# EAGLE design through_hole_v2_proto (EAGLE 5.12)
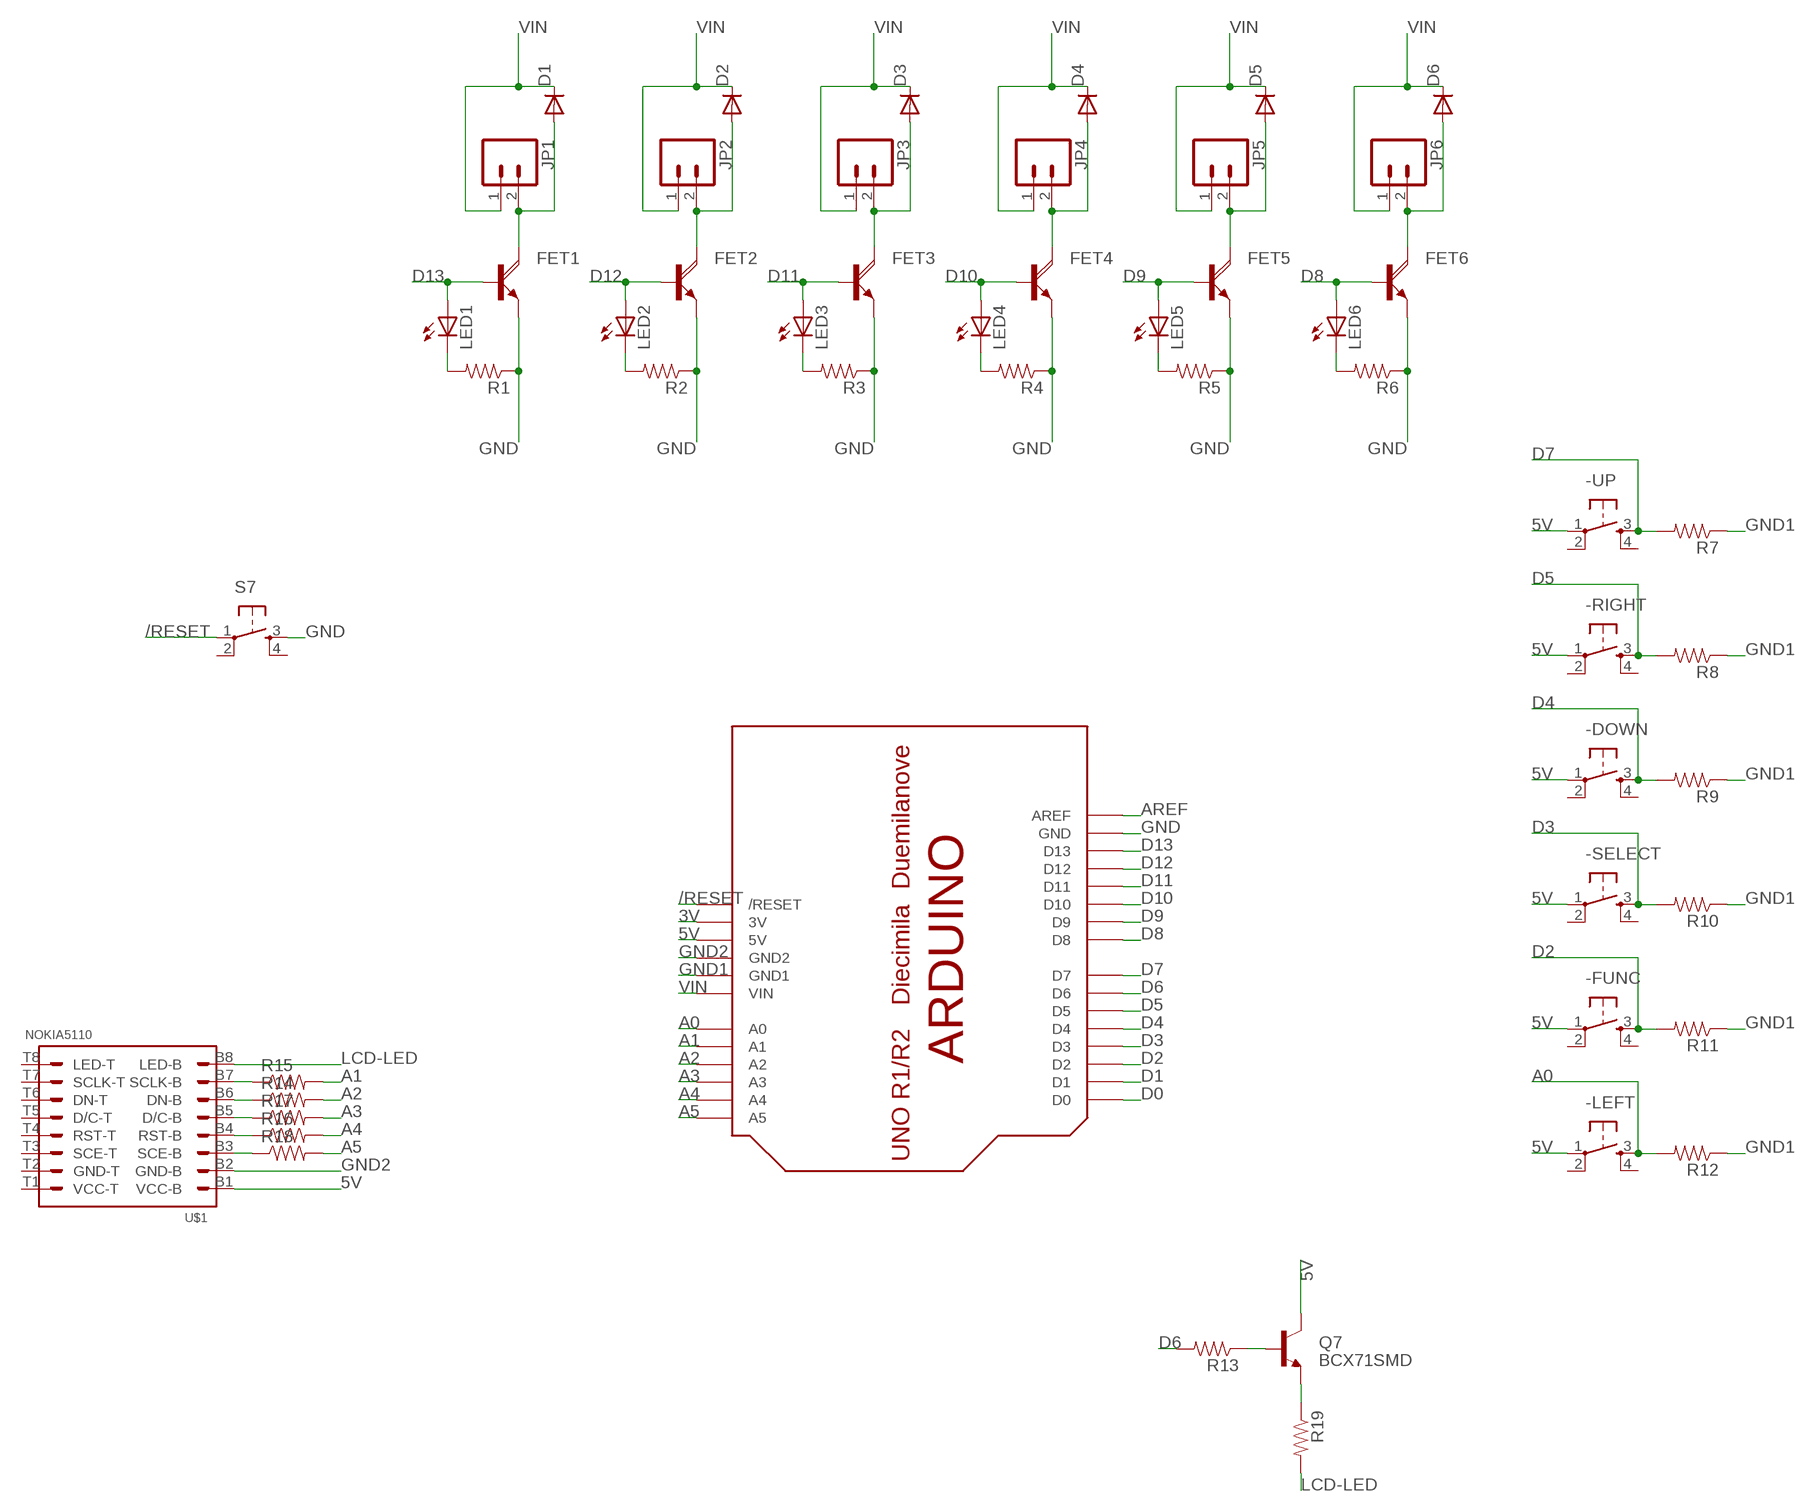
[diagram p0: schematic, sheet 1]

## Parts
-DOWN  TAC_SWITCHPTH  [TACTILE-PTH]
-FUNC  TAC_SWITCHPTH  [TACTILE-PTH]
-LEFT  TAC_SWITCHPTH  [TACTILE-PTH]
-RIGHT  TAC_SWITCHPTH  [TACTILE-PTH]
-SELECT  TAC_SWITCHPTH  [TACTILE-PTH]
-UP  TAC_SWITCHPTH  [TACTILE-PTH]
D1  DIODE1N4148  [DIODE-1N4148]
D2  DIODE1N4148  [DIODE-1N4148]
D3  DIODE1N4148  [DIODE-1N4148]
D4  DIODE1N4148  [DIODE-1N4148]
D5  DIODE1N4148  [DIODE-1N4148]
D6  DIODE1N4148  [DIODE-1N4148]
FET1  TIP120  [TO220AH]
FET2  TIP120  [TO220AH]
FET3  TIP120  [TO220AH]
FET4  TIP120  [TO220AH]
FET5  TIP120  [TO220AH]
FET6  TIP120  [TO220AH]
JP1  M02LOCK_LONGPADS  [1X02_LOCK_LONGPADS]
JP2  M02LOCK_LONGPADS  [1X02_LOCK_LONGPADS]
JP3  M02LOCK_LONGPADS  [1X02_LOCK_LONGPADS]
JP4  M02LOCK_LONGPADS  [1X02_LOCK_LONGPADS]
JP5  M02LOCK_LONGPADS  [1X02_LOCK_LONGPADS]
JP6  M02LOCK_LONGPADS  [1X02_LOCK_LONGPADS]
LED1  LED3MM  [LED3MM]
LED2  LED3MM  [LED3MM]
LED3  LED3MM  [LED3MM]
LED4  LED3MM  [LED3MM]
LED5  LED3MM  [LED3MM]
LED6  LED3MM  [LED3MM]
Q7  BCX71SMD  TRANSISTOR_NPNTO92  [TO-92]
R1  RESISTORPTH1  [AXIAL-0.3]
R2  RESISTORPTH1  [AXIAL-0.3]
R3  RESISTORPTH1  [AXIAL-0.3]
R4  RESISTORPTH1  [AXIAL-0.3]
R5  RESISTORPTH1  [AXIAL-0.3]
R6  RESISTORPTH1  [AXIAL-0.3]
R7  RESISTORPTH1  [AXIAL-0.3]
R8  RESISTORPTH1  [AXIAL-0.3]
R9  RESISTORPTH1  [AXIAL-0.3]
R10  RESISTORPTH1  [AXIAL-0.3]
R11  RESISTORPTH1  [AXIAL-0.3]
R12  RESISTORPTH1  [AXIAL-0.3]
R13  RESISTORPTH1  [AXIAL-0.3]
R14  RESISTORPTH1  [AXIAL-0.3]
R15  RESISTORPTH1  [AXIAL-0.3]
R16  RESISTORPTH1  [AXIAL-0.3]
R17  RESISTORPTH1  [AXIAL-0.3]
R18  RESISTORPTH1  [AXIAL-0.3]
R19  RESISTORPTH1  [AXIAL-0.3]
S7  TAC_SWITCHPTH  [TACTILE-PTH]
U$1  NOKIA5110  [NOKIA5110]
U$2  ARDUINOUNO  [ARDUINO]

## Nets
3V: U$2.3V
5V: -DOWN.1 -FUNC.1 -LEFT.1 -RIGHT.1 -SELECT.1 -UP.1 Q7.3(C) U$1.B1(VCC-B) U$2.5V
/RESET: S7.1 U$2.RESET(/RESET)
A0: -LEFT.3 R12.P$2 U$2.A0
A1: R15.P$2 U$2.A1
A2: R14.P$2 U$2.A2
A3: R17.P$2 U$2.A3
A4: R16.P$2 U$2.A4
A5: R18.P$2 U$2.A5
AREF: U$2.AREF
D0: U$2.D0
D1: U$2.D1
D2: -FUNC.3 R11.P$2 U$2.D2
D3: -SELECT.3 R10.P$2 U$2.D3
D4: -DOWN.3 R9.P$2 U$2.D4
D5: -RIGHT.3 R8.P$2 U$2.D5
D6: R13.P$2 U$2.D6
D7: -UP.3 R7.P$2 U$2.D7
D8: FET6.B LED6.A U$2.D8
D9: FET5.B LED5.A U$2.D9
D10: FET4.B LED4.A U$2.D10
D11: FET3.B LED3.A U$2.D11
D12: FET2.B LED2.A U$2.D12
D13: FET1.B LED1.A U$2.D13
GND: FET1.E FET2.E FET3.E FET4.E FET5.E FET6.E R1.P$1 R2.P$1 R3.P$1 R4.P$1 R5.P$1 R6.P$1 S7.3 U$2.GND
GND1: R7.P$1 R8.P$1 R9.P$1 R10.P$1 R11.P$1 R12.P$1 U$2.GND1
GND2: U$1.B2(GND-B) U$2.GND2
LCD-LED: R19.P$2 U$1.B8(LED-B)
N$1: LED2.K(C) R2.P$2
N$2: LED1.K(C) R1.P$2
N$3: D2.A FET2.C JP2.2
N$4: Q7.2(B) R13.P$1
N$5: LED3.K(C) R3.P$2
N$6: R15.P$1 U$1.B7(SCLK-B)
N$7: D3.A FET3.C JP3.2
N$8: LED4.K(C) R4.P$2
N$9: D4.A FET4.C JP4.2
N$10: LED5.K(C) R5.P$2
N$11: D5.A FET5.C JP5.2
N$12: LED6.K(C) R6.P$2
N$13: D1.A FET1.C JP1.2
N$14: D6.A FET6.C JP6.2
N$16: Q7.1(E) R19.P$1
N$32: R14.P$1 U$1.B6(DN-B)
N$36: R17.P$1 U$1.B5(D/C-B)
N$38: R16.P$1 U$1.B4(RST-B)
N$39: R18.P$1 U$1.B3(SCE-B)
VIN: D1.C D2.C D3.C D4.C D5.C D6.C JP1.1 JP2.1 JP3.1 JP4.1 JP5.1 JP6.1 U$2.VIN
Unconnected: -DOWN.2 -DOWN.4 -FUNC.2 -FUNC.4 -LEFT.2 -LEFT.4 -RIGHT.2 -RIGHT.4 -SELECT.2 -SELECT.4 -UP.2 -UP.4 S7.2 S7.4 U$1.T1(VCC-T) U$1.T2(GND-T) U$1.T3(SCE-T) U$1.T4(RST-T) U$1.T5(D/C-T) U$1.T6(DN-T) U$1.T7(SCLK-T) U$1.T8(LED-T)

## Library data of the parts
-DOWN -FUNC -LEFT -RIGHT -SELECT -UP S7 = SparkFun:TAC_SWITCH: Momentary Switch Button commonly used for reset or general input. Spark Fun Electronics SKU : COM-00097
D1-D6 = SparkFun:DIODE: Diode These are standard reverse protection diodes and small signal diodes. SMA package can handle up to about 1A. SOD-323 can handle about 200mA. What the SOD-323 package when ordering, there are some mfgs out there that are 5-pin packages.
FET1-FET6 = jowan-transistor-power:TIP120: NPN DARLINGTON TRANSISTOR
JP1-JP6 = SparkFun:M02: Header 2 Standard 2-pin 0.1" header. Use with straight break away headers (SKU : PRT-00116), right angle break away headers (PRT-00553), swiss pins (PRT-00743), machine pins (PRT-00117), and female headers (PRT-00115). Molex polarized connector foot print use with SKU : PRT-08233 with associated crimp pins and housings.
LED1-LED6 = adafruit:LED: LED OSRAM: - CHIPLED LG R971, LG N971, LY N971, LG Q971, LY Q971, LO R971, LY R971 LH N974, LH R974 LS Q976, LO Q976, LY Q976 LO Q996 - Hyper CHIPLED LW Q18S LB Q993, LB Q99A, LB R99A - SideLED LS A670, LO A670, LY A670, LG A670, LP A670 LB A673, LV A673, LT A673, LW A673 LH A674 LY A675 LS A676, LA A676, LO A676, LY A676, LW A676 LS A679, LY A679, LG A679 - Hyper Micro SIDELED® LS Y876, LA Y876, LO Y876, LY Y876 LT Y87S - SmartLED LW L88C, LW L88S LB L89C, LB L89S, LG L890 LS L89K, LO L89K, LY L89K LS L896, LA L896, LO L896, LY L896 - TOPLED LS T670, LO T670, LY T670, LG T670, LP T670 LSG T670, LSP T670, LSY T670, LOP T670, LYG T670 LG T671, LOG T671, LSG T671 LB T673, LV T673, LT T673, LW T673 LH T674 LS T676, LA T676, LO T676, LY T676, LB T676, LH T676, LSB T676, LW T676 LB T67C, LV T67C, LT T67C, LS T67K, LO T67K, LY T67K, LW E67C LS E67B, LA E67B, LO E67B, LY E67B, LB E67C, LV E67C, LT E67C LW T67C LS T679, LY T679, LG T679 LS T770, LO T770, LY T770, LG T770, LP T770 LB T773, LV T773, LT T773, LW T773 LH T774 LS E675, LA E675, LY E675, LS T675 LS T776, LA T776, LO T776, LY T776, LB T776 LHGB T686 LT T68C, LB T68C - Hyper Mini TOPLED® LB M676 - Mini TOPLED Santana® LG M470 LS M47K, LO M47K, LY M47K Source: http://www.osram.convergy.de/
Q7 = SparkFun:TRANSISTOR_NPN: Transistor NPN BJT configuration in SOT23 package. MMBT2222 is the common NPN we use. Double check BCE configuration again layout.
R1-R19 = SparkFun:RESISTOR: Resistor Basic schematic elements and footprints for 0603, 1206, and PTH 1/10th watt (small) resistors.
U$1 = CustomLib:NOKIA5110
U$2 = jowan_ard:ARDUINO: Arduino Diecimila/Duemilanove Make a shield with ease, this package has all the named pins as well as the two mounting drill holes and an outline of the USB and DC power connector. The outline is on the DIMENSION layer, so if your board house uses it they will cut the outline to match. http://www.ladyada.net/library/pcb/eaglelibrary.html

## Board
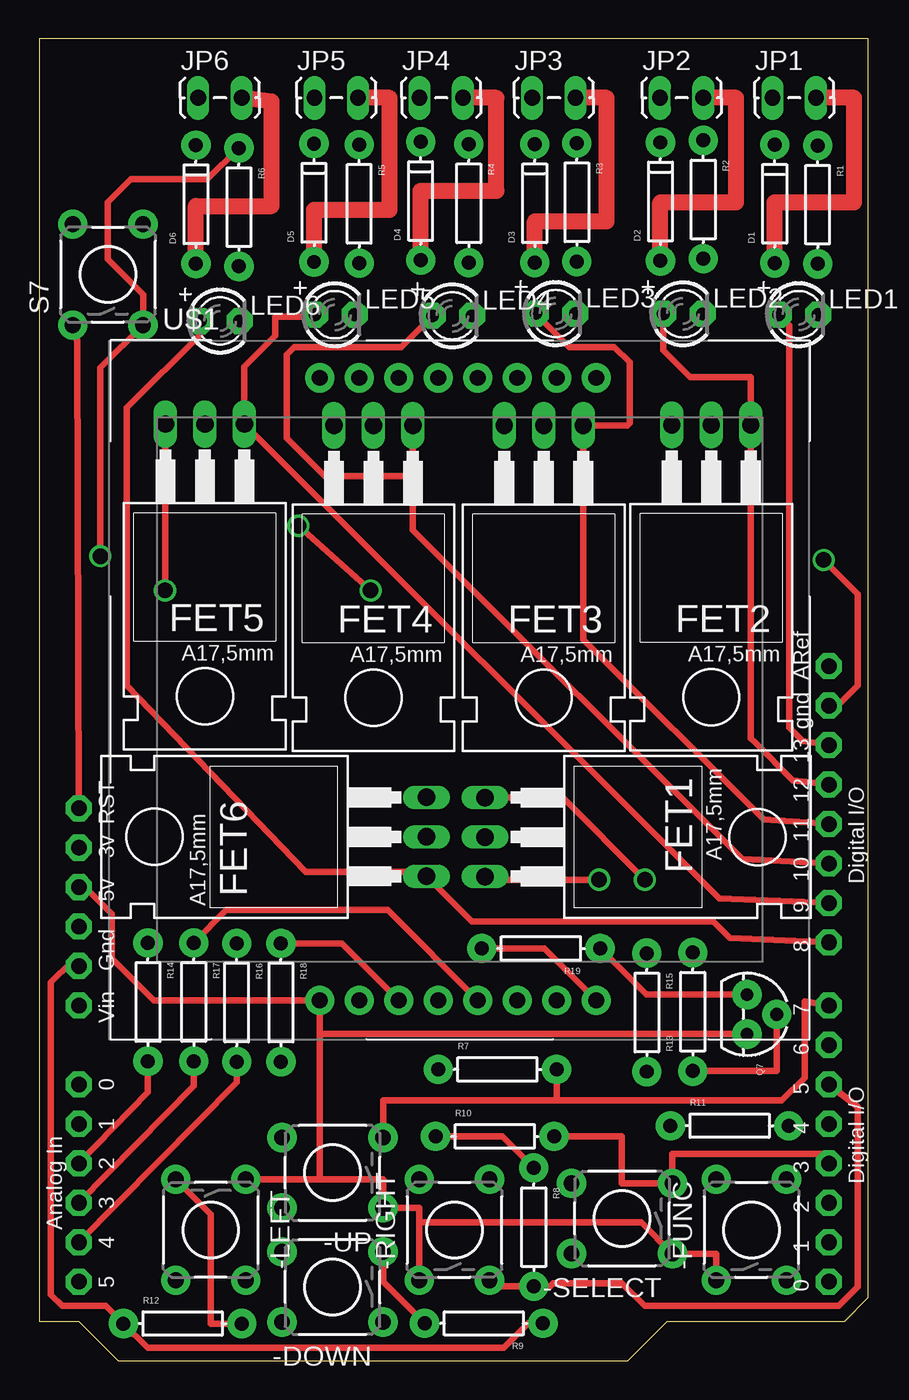
[diagram p1: board, top side]
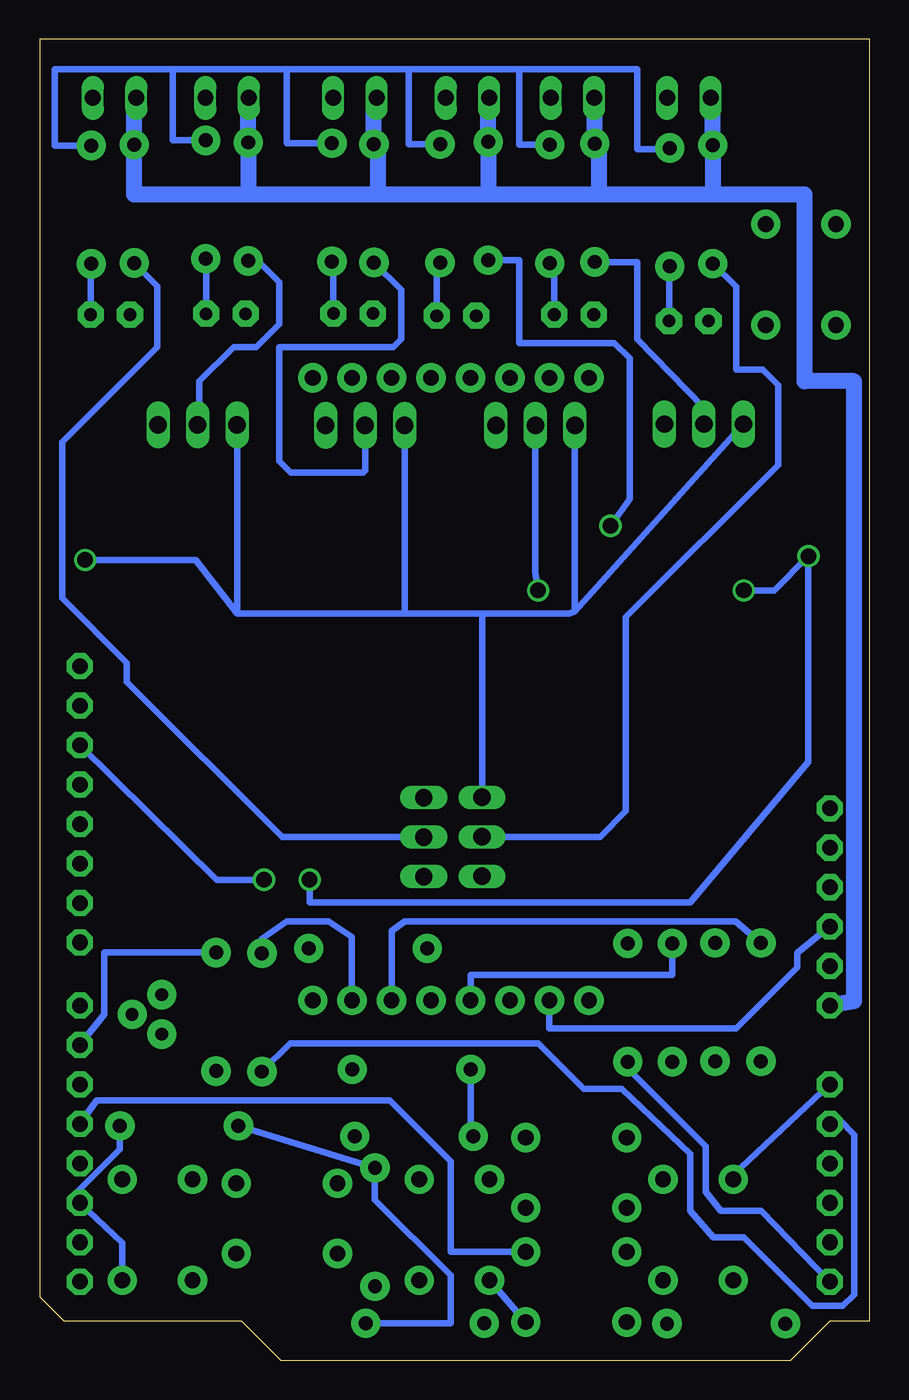
[diagram p2: board, bottom side, seen from below]

Size 53.34 x 85.09 mm. Coordinates in mm from the lower left corner, seen from the top.
Copper layers (1*16): Top 0.035mm / dielectric 1.5mm / Bottom 0.035mm
Design rules "PCB-POOL HighSpec": minimum track width 0.125mm, minimum drill 0.2mm, track to track 0.125mm, track to pad 0.125mm, pad to pad 0.125mm, via to via 0.125mm, smd to smd 0.125mm, copper to edge 0.3mm, drill to drill 0.2mm, minimum pad ring 0.2mm, minimum via ring 0.125mm, stop-mask expansion 0.075mm, vias tented up to drill 0mil, thermal gap 0.2mm

### Footprints (pad centres in the part's own frame; a part is rotated, then mirrored left to right if it is on the bottom)
TACTILE-PTH = drill 1.016 pad 1.88 round: 1 -3.251,2.261; 2 3.251,2.261; 3 -3.251,-2.261; 4 3.251,-2.261
DIODE-1N4148 = drill 0.9 pad 1.88 round: A -3.81,0; C 3.81,0
TO220AH = drill 1.118 long: B -2.54,-6.35; C 0,-6.35; E 2.54,-6.35
1X02_LOCK_LONGPADS = drill 1.016 long: 1 -0.127,0; 2 2.667,0
LED3MM = drill 0.813 pad 1.676 octagon: A -1.27,0; K 1.27,0
TO-92 = drill 0.813 pad 1.88 round: 1 -1.27,0; 2 0,1.905; 3 1.27,0
AXIAL-0.3 = drill 0.9 pad 1.88 round: P$1 -3.81,0; P$2 3.81,0
NOKIA5110 = drill 1.016 pad 1.88 round: B1 -0.01,0; B2 2.53,0; B3 5.07,0; B4 7.61,0; B5 10.15,0; B6 12.69,0; B7 15.23,0; B8 17.77,0; T1 -0.01,40.08; T2 2.53,40.08; T3 5.07,40.08; T4 7.61,40.08; T5 10.15,40.08; T6 12.69,40.08; T7 15.23,40.08; T8 17.77,40.08
ARDUINO = drill 1 pad 1.676 octagon: 3V 52.07,2.54; 5V 54.61,2.54; A0 67.31,2.54; A1 69.85,2.54; A2 72.39,2.54; A3 74.93,2.54; A4 77.47,2.54; A5 80.01,2.54; AREF 40.386,50.8; D0 80.01,50.8; D1 77.47,50.8; D2 74.93,50.8; D3 72.39,50.8; D4 69.85,50.8; D5 67.31,50.8; D6 64.77,50.8; D7 62.23,50.8; D8 58.166,50.8; D9 55.626,50.8; D10 53.086,50.8; D11 50.546,50.8; D12 48.006,50.8; D13 45.466,50.8; GND 42.926,50.8; GND1 59.69,2.54; GND2 57.15,2.54; RESET 49.53,2.54; VIN 62.23,2.54

### Placement (x,y rotation side)
-DOWN  18.86,4.75 180 top
-FUNC  45.81,8.42 90 top
-LEFT  11.03,8.42 270 top
-RIGHT  26.7,8.42 90 top
-SELECT  37.48,9.16 180 top
-UP  18.86,12.1 180 top
D1  47.31,74.47 90 top
D2  39.97,74.61 90 top
D3  31.88,74.51 90 top
D4  24.53,74.65 90 top
D5  17.67,74.54 90 top
D6  10.07,74.44 90 top
FET1  35.03,33.71 270 top
FET2  43.23,53.88 180 top
FET3  32.45,53.85 180 top
FET4  21.5,53.85 180 top
FET5  10.65,53.94 180 top
FET6  18.57,33.72 90 top
JP1  47.3,81.3 0 top
JP2  40.06,81.3 0 top
JP3  31.84,81.3 0 top
JP4  24.59,81.3 0 top
JP5  17.84,81.3 0 top
JP6  10.35,81.3 0 top
LED1  48.85,67.34 0 top
LED2  41.41,67.4 0 top
LED3  33.22,67.41 0 top
LED4  26.57,67.27 0 top
LED5  19.01,67.34 0 top
LED6  11.62,66.93 0 top
Q7  45.54,22.3 270 top
R1  50.08,74.42 270 top
R2  42.72,74.75 270 top
R3  34.59,74.57 270 top
R4  27.63,74.5 270 top
R5  20.57,74.47 270 top
R6  12.84,74.26 270 top
R7  29.47,18.75 0 top
R8  31.82,8.6 270 top
R9  28.59,2.4 180 top
R10  29.3,14.44 0 top
R11  44.41,15.13 0 top
R12  9.21,2.39 0 top
R13  42.05,22.46 90 top
R14  6.98,23.09 270 top
R15  39.09,22.42 270 top
R16  12.69,23.06 270 top
R17  9.93,23.09 270 top
R18  15.54,23.06 270 top
R19  32.27,26.54 180 top
S7  4.41,69.92 90 top
U$1  18.06,23.19 0 top
U$2  0,85.09 270 top

### Tracks (layer width: path | path; a pad name or v marks a point on that pad's centre or on a via)
5V
  Top 0.406: 18.05,11.67 -LEFT.1 | -RIGHT.1 24.44,8.91 | 24.44,8.91 24.44,9.83 -UP.1 22.12,11.67 18.05,11.67 | -FUNC.1 43.55,6.89 -SELECT.1 38.72,8.91 24.44,8.91 | U$2.5V 2.68,30.73 4.66,28.76 4.66,25.89 7.35,23.19 U$1.B1 18.05,21.03 | 18.05,21.03 Q7.3 | 18.05,11.67 18.05,21.03
  Bottom 0.406: -DOWN.1 -RIGHT.1
/RESET
  Top 0.406: U$2.RESET 2.44,65.64 S7.1
A0
  Top 0.406: R12.P$2 11.03,2.39 11.03,9.41 -LEFT.3
  Bottom 0.406: U$2.A0 8.76,11.98 -LEFT.3
A1
  Bottom 0.406: U$2.A1 1.96,15.52 0.98,14.55 0.98,4.26 1.72,3.52 3.67,3.52 8.09,7.93 10.04,7.93 11.52,9.65 11.52,13.32 15.93,17.49 18.38,17.49 21.32,20.43 37.27,20.43 R15.P$2
A2
  Top 0.406: U$2.A2 6.98,17.28 R14.P$2
A3
  Top 0.406: U$2.A3 9.93,17.69 R17.P$2
A4
  Top 0.406: U$2.A4 12.69,17.91 R16.P$2
A5
  Bottom 0.406: U$2.A5 6.96,9.65 9.55,9.65 10.54,10.87 10.54,13.81 15.54,18.82 R18.P$2
D2
  Bottom 0.406: R11.P$2 48.23,13.61 50.94,10.89 U$2.D2 48.08,7.58 -FUNC.3
D3
  Top 0.406: R10.P$2 37.48,14.44 37.48,11.42 -SELECT.3 40.74,13.32 50.84,13.32 U$2.D3
D4
  Top 0.406: R9.P$2 22.12,5.07 -DOWN.3
  Bottom 0.406: -DOWN.3 26.95,7.01 26.95,12.83 30.87,16.75 49.71,16.75 U$2.D4
D5
  Top 0.406: -RIGHT.3 29.35,4.79 R8.P$2 32.87,4.79 33.08,4.99 37.48,4.99 38.95,3.52 51.45,3.52 52.67,4.75 52.67,16.33 U$2.D5
D6
  Bottom 0.406: U$2.D6 49.24,22.3 49.24,26.27 R13.P$2
D7
  Top 0.406: U$2.D7 49.24,23.14 49.24,18.22 47.77,16.75 33.32,16.75 | 33.32,16.75 22.12,16.75 -UP.3 | R7.P$2 33.28,16.79 33.32,16.75
D8
  Top 0.406: U$2.D8 44.43,27.2 43.37,28.27 27.84,28.27 FET6.B 24.65,31.45 17.15,31.45 5.63,43.46 5.63,61.34 10.36,66.06 LED6.A
D9
  Top 0.406: U$2.D9 43.74,29.74 FET5.B 13.19,64 15.19,66 15.19,67.22 17.74,67.22 LED5.A
D10
  Top 0.406: U$2.D10 45.23,32.28 24.04,53.48 24.04,56.93 | 24.04,56.93 FET4.B | LED4.A 23.3,65.26 16.41,65.26 15.93,64.77 15.93,59.38 18.38,56.93 24.04,56.93
D11
  Top 0.406: U$2.D11 46.61,34.82 34.99,46.44 FET3.B 37.81,60.2 37.98,60.36 37.98,64.28 36.99,65.26 34.09,65.26 LED3.A
D12
  Top 0.406: U$2.D12 48.48,37.36 46.06,39.78 45.77,40.07 FET2.B 45.77,63.3 41.9,63.3 40.14,65.06 LED2.A
D13  (via drill 1 pad 1.42)
  Top 0.406: FET1.B 33.67,36.25 v38.95,30.96 | U$2.D13 49.12,39.9 48.27,40.76 48.27,66.66 LED1.A
  Bottom 0.406: v38.95,30.96 42,30.96 U$2.D13
GND  (via drill 1 pad 1.42)
  Top 0.406: R6.P$1 10.81,76.04 5.88,76.04 4.41,74.57 4.41,70.9 6.67,68.63 S7.3 3.92,63.91 v3.92,51.79 | U$2.GND 51.38,42.16 52.67,43.46 52.67,49.34 v50.47,51.54 | v8.09,49.58 8.11,50.29 FET5.E | FET1.E 28.89,30.96 v36.02,30.96
  Bottom 0.406: 22.54,83.15 14.95,83.15 14.95,78 12.84,78 R6.P$1 | 22.54,83.15 29.64,83.15 | 29.64,83.15 37.48,83.15 | 37.48,83.15 44.84,83.15 | 44.84,83.15 52.43,83.15 52.43,78.23 R1.P$1 | 22.54,83.15 22.54,78.28 R5.P$1 | 29.64,83.15 29.64,78.31 R4.P$1 | 37.48,83.15 37.48,78.38 R3.P$1 | 44.84,83.15 44.84,78.56 R2.P$1 | 24.99,48.11 19.31,48.11 18.95,48.22 | 24.99,48.11 29.89,48.11 | 29.89,48.11 40.67,48.11 | FET5.E 18.95,48.22 | 18.95,48.22 FET4.E | FET3.E 29.91,49.12 29.89,48.11 | FET2.E 40.7,49.31 40.67,48.11 | FET6.E 24.92,48.04 24.99,48.11 | v50.47,51.54 43.37,51.54 40.67,48.11 | v8.09,49.58 6.12,49.58 v3.92,51.79 3.92,38.56 11.52,29.49 36.02,29.49 v36.02,30.96
GND1
  Top 0.406: R8.P$1 29.78,14.44 R10.P$1 | R9.P$1 31.46,2.4 29.89,0.83 6.96,0.83 R12.P$1 4.27,3.52 1.47,3.52 0.73,4.26 0.73,24.35 2.07,25.68 U$2.GND1
  Bottom 0.406: R11.P$1 R8.P$1 31.82,10.35 26.95,5.48 26.95,2.4 R9.P$1 | R7.P$1 25.66,14.61 R10.P$1
GND2
  Bottom 0.406: U$1.B2 20.59,21.41 8.57,21.41 4.66,25.33 4.66,26.25 U$2.GND2
LCD-LED
  Top 0.406: R19.P$2 32.49,26.54 U$1.B8
N$1
  Bottom 0.406: LED2.K 42.68,70.94 R2.P$2
N$2
  Bottom 0.406: LED1.K 50.12,70.61 R1.P$2
N$3
  Top 1.016: JP2.2 44.84,81.3 44.84,74.57 39.97,74.57 D2.A
  Bottom 0.406: FET2.C 43.12,60.35 43.12,63.06 40.91,65.26 39.45,65.26 37.98,66.73 37.98,69.42 39.35,70.8 D2.A
N$4
  Top 0.406: R13.P$1 47.45,18.65 Q7.2
N$5
  Bottom 0.406: LED3.K 34.49,70.76 R3.P$2
N$6
  Bottom 0.406: R15.P$1 39.09,27.15 37.48,28.27 34.79,28.27 33.32,27.29 33.32,23.22 U$1.B7
N$7
  Top 1.016: JP3.2 36.51,81.3 36.51,73.34 31.88,73.34 D3.A
  Bottom 0.406: D3.A 30.14,68.95 30.14,65.75 30.62,65.26 37.98,65.26 37.98,57.91 37.24,57.18 32.59,57.18 32.45,57.31 FET3.C
N$8
  Bottom 0.406: LED4.K 27.84,70.69 R4.P$2
N$9  (via drill 1 pad 1.42)
  Top 0.406: v21.32,49.58 v16.66,53.75
  Top 1.016: JP4.2 29.4,81.3 29.4,75.31 24.53,75.31 D4.A
  Bottom 0.406: D4.A 22.54,70.84 22.54,65.51 16.41,65.51 15.44,64.53 15.44,55.46 v16.66,53.75 | v21.32,49.58 21.5,50.74 FET4.C
N$10
  Bottom 0.406: LED5.K 20.28,70.66 R5.P$2
N$11
  Top 1.016: JP5.2 22.54,81.3 22.54,74.08 17.67,74.08 D5.A
  Bottom 0.406: FET5.C 10.65,61.34 14.95,65.75 14.95,70.73 D5.A
N$12
  Bottom 0.406: LED6.K 12.89,70.45 R6.P$2
N$13
  Top 1.016: JP1.2 52.43,81.3 52.43,74.57 47.31,74.57 D1.A
  Bottom 0.406: FET1.C 37.78,33.71 47.77,43.7 47.77,44.93 51.94,49.09 51.94,59.14 45.81,65.26 45.81,69.16 D1.A
N$14
  Top 1.016: JP6.2 14.95,81.05 14.95,74.33 10.07,74.33 D6.A
  Bottom 0.406: D6.A 8.57,69.12 8.57,63.79 6.86,63.79 5.88,62.81 5.88,57.67 15.68,47.87 15.68,35.37 17.33,33.72 FET6.C
N$16
  Top 0.406: R19.P$1 39.05,23.57 Q7.1
N$32
  Bottom 0.406: U$1.B6 30.75,27.65 29.89,28.27 8.6,28.27 R14.P$1
N$36
  Top 0.406: R17.P$1 12.04,29 22.4,29 U$1.B5
N$38
  Bottom 0.406: U$1.B4 25.67,24.84 12.69,24.84 R16.P$1
N$39
  Top 0.406: R18.P$1 19.45,26.87 U$1.B3
VIN
  Bottom 1.016: U$2.VIN 0.98,23.14 0.98,63.06 4.17,63.06 4.17,75.06 10.04,75.06 | 10.04,75.06 17.39,75.06 | 17.39,75.06 24.5,75.06 | 24.5,75.06 31.61,75.06 | 31.61,75.06 39.94,75.06 | 39.94,75.06 47.31,75.06 D1.C 47.31,81.3 JP1.1 | 39.94,75.06 39.94,78.42 D2.C 39.97,81.3 JP2.1 | 31.61,75.06 31.61,78.31 D3.C 31.88,81.3 JP3.1 | 24.5,75.06 24.5,78.45 D4.C 24.53,81.3 JP4.1 | 17.39,75.06 17.39,78.35 D5.C 17.67,81.3 JP5.1 | 10.04,75.06 10.04,78.25 D6.C 10.07,81.05 JP6.1